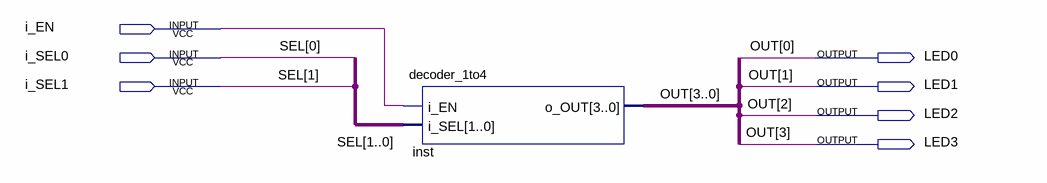
[diagram p0: schematic sheet]
// Quartus schematic decoder_1to4_schmatic.bdf as structural Verilog: 1 symbols, 7 pins
module decoder_1to4_schmatic (
  input  i_EN,
  input  i_SEL0,
  input  i_SEL1,
  output LED0,
  output LED1,
  output LED2,
  output LED3
);

  decoder_1to4 inst (.i_EN(i_EN), .i_SEL({i_SEL1, i_SEL0}), .o_OUT({LED3, LED2, LED1, LED0}));

  // Other names for the same wires on the sheet: OUT[3:0] = {LED3, LED2, LED1, LED0}; SEL[1:0] = {i_SEL1, i_SEL0}
endmodule
